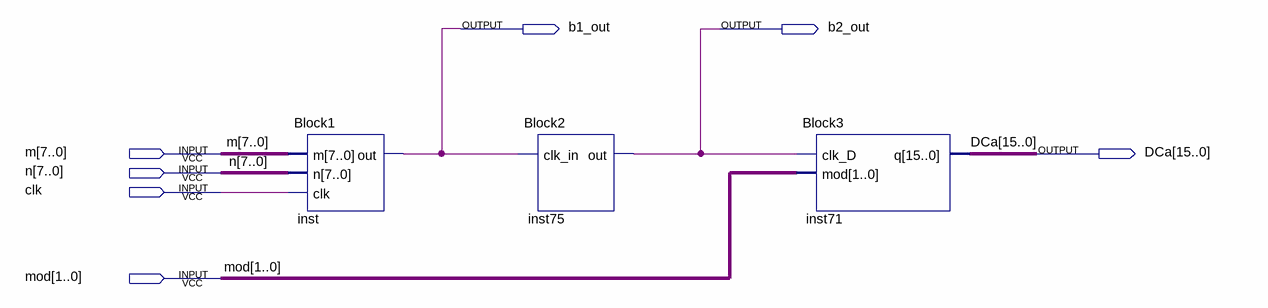
[diagram p0: schematic sheet]
// Quartus schematic CombinedBlocks.bdf as structural Verilog: 3 symbols, 7 pins
module CombinedBlocks (
  input  [7:0] m,
  input  [7:0] n,
  input  clk,
  input  [1:0] mod,
  output b1_out,
  output b2_out,
  output [15:0] DCa
);

  Block1 inst (.m(m), .n(n), .clk(clk), .out(b1_out));
  Block2 inst75 (.clk_in(b1_out), .out(b2_out));
  Block3 inst71 (.clk_D(b2_out), .mod(mod), .q(DCa));
endmodule
